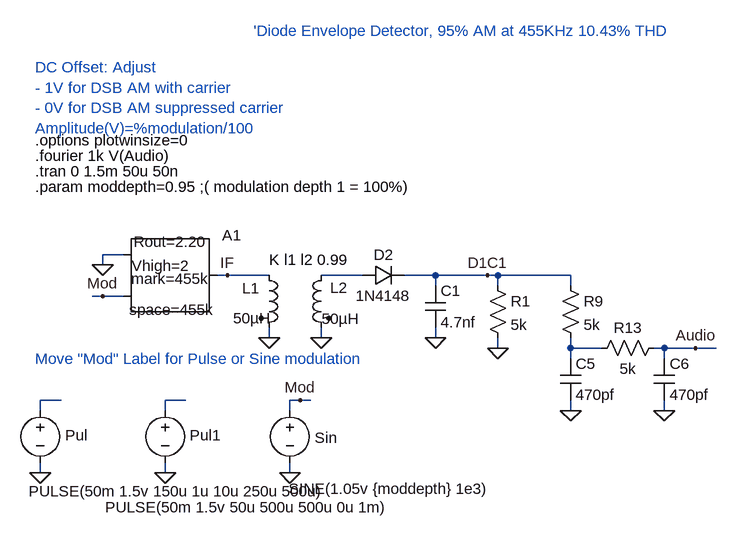
[diagram p0: schematic diode01.asc]
diode01.asc, the LTspice schematic file:
Version 4
SHEET 1 1240 792
WIRE -112 304 -144 304
WIRE -144 320 -144 304
WIRE 48 336 32 336
WIRE 112 336 48 336
WIRE 256 336 192 336
WIRE 368 336 320 336
WIRE 448 336 368 336
WIRE 464 336 448 336
WIRE 576 336 464 336
WIRE 368 352 368 336
WIRE 464 352 464 336
WIRE 576 352 576 336
WIRE -144 368 -160 368
WIRE -112 368 -144 368
WIRE 112 432 112 416
WIRE 192 432 192 416
WIRE 368 432 368 416
WIRE 464 448 464 432
WIRE 576 448 576 432
WIRE 624 448 576 448
WIRE 720 448 704 448
WIRE 768 448 720 448
WIRE 800 448 768 448
WIRE 576 464 576 448
WIRE 720 464 720 448
WIRE -208 528 -240 528
WIRE -16 528 -48 528
WIRE 160 528 144 528
WIRE 176 528 160 528
WIRE -240 544 -240 528
WIRE -48 544 -48 528
WIRE 144 544 144 528
WIRE 576 544 576 528
WIRE 720 544 720 528
WIRE -240 640 -240 624
WIRE -48 640 -48 624
WIRE 144 640 144 624
FLAG 144 640 0
FLAG -144 320 0
FLAG 48 336 IF
FLAG 768 448 Audio
FLAG 576 544 0
FLAG 720 544 0
FLAG -240 640 0
FLAG -144 368 Mod
FLAG 160 528 Mod
FLAG -48 640 0
FLAG 368 432 0
FLAG 448 336 D1C1
FLAG 112 432 0
FLAG 192 432 0
FLAG 464 448 0
SYMBOL SpecialFunctions\\modulate -112 304 R0
WINDOW 39 12 37 Left 0
WINDOW 40 9 85 Left 0
WINDOW 3 16 -20 Left 0
WINDOW 123 13 17 Left 0
SYMATTR SpiceLine mark=455k
SYMATTR SpiceLine2 space=455k
SYMATTR Value Rout=2.20
SYMATTR Value2 Vhigh=2
SYMATTR InstName A1
SYMBOL voltage 144 528 R0
WINDOW 123 0 0 Left 0
WINDOW 39 0 0 Left 0
WINDOW 0 38 58 Left 0
WINDOW 3 -2 136 Left 0
SYMATTR InstName Sin
SYMATTR Value SINE(1.05v {moddepth} 1e3)
SYMBOL res 560 336 R0
SYMATTR InstName R9
SYMATTR Value 5k
SYMBOL cap 560 464 R0
SYMATTR InstName C5
SYMATTR Value 470pf
SYMBOL res 720 432 R90
WINDOW 0 0 56 VBottom 0
WINDOW 3 32 56 VTop 0
SYMATTR InstName R13
SYMATTR Value 5k
SYMBOL cap 704 464 R0
SYMATTR InstName C6
SYMATTR Value 470pf
SYMBOL VOLTAGE -240 528 R0
WINDOW 0 38 54 Left 0
WINDOW 3 -18 140 Left 0
WINDOW 123 0 0 Left 0
WINDOW 39 0 0 Left 0
SYMATTR InstName Pul
SYMATTR Value PULSE(50m 1.5v 150u 1u 10u 250u 500u)
SYMBOL VOLTAGE -48 528 R0
WINDOW 0 38 54 Left 0
WINDOW 3 -92 165 Left 0
WINDOW 123 0 0 Left 0
WINDOW 39 0 0 Left 0
SYMATTR InstName Pul1
SYMATTR Value PULSE(50m 1.5v 50u 500u 500u 0u 1m)
SYMBOL cap 352 352 R0
SYMATTR InstName C1
SYMATTR Value 4.7nf
SYMBOL res 448 336 R0
SYMATTR InstName R1
SYMATTR Value 5k
SYMBOL diode 256 352 R270
WINDOW 0 32 32 VTop 0
WINDOW 3 0 32 VBottom 0
SYMATTR InstName D2
SYMATTR Value 1N4148
SYMBOL ind2 96 320 R0
WINDOW 0 -25 36 Left 0
WINDOW 3 -39 82 Left 0
SYMATTR InstName L1
SYMATTR Value 50µH
SYMATTR Type ind
SYMBOL ind2 208 320 M0
WINDOW 0 -25 35 Left 0
WINDOW 3 -43 83 Left 0
SYMATTR InstName L2
SYMATTR Value 50µH
SYMATTR Type ind
TEXT -248 152 Left 0 !.fourier 1k V(Audio)
TEXT -248 176 Left 0 !.tran 0 1.5m 50u 50n
TEXT -248 128 Left 0 !.options plotwinsize=0
TEXT 88 -40 Left 0 ;'Diode Envelope Detector, 95% AM at 455KHz 10.43% THD
TEXT -248 16 Left 0 ;DC Offset: Adjust\n- 1V for DSB AM with carrier\n- 0V for DSB AM suppressed carrier\nAmplitude(V)=%modulation/100
TEXT -248 200 Left 0 !.param moddepth=0.95 ;( modulation depth 1 = 100%)
TEXT -248 464 Left 0 ;Move "Mod" Label for Pulse or Sine modulation
TEXT 112 312 Left 0 !K l1 l2 0.99

The netlist it stands for:
* diode01.asc
A1 0 Mod 0 0 0 0 IF 0 MODULATOR Rout=2.20 Vhigh=2 mark=455k space=455k
V§Sin Mod 0 SINE(1.05v {moddepth} 1e3)
R9 D1C1 N002 5k
C5 N002 0 470pf
R13 Audio N002 5k
C6 Audio 0 470pf
V§Pul N003 0 PULSE(50m 1.5v 150u 1u 10u 250u 500u)
V§Pul1 N004 0 PULSE(50m 1.5v 50u 500u 500u 0u 1m)
C1 D1C1 0 4.7nf
R1 D1C1 0 5k
D2 N001 D1C1 1N4148
L1 IF 0 50µH
L2 N001 0 50µH
.model D D
.lib standard.dio
.fourier 1k V(Audio)
.tran 0 1.5m 50u 50n
.options plotwinsize=0
* 'Diode Envelope Detector, 95% AM at 455KHz 10.43% THD
* DC Offset: Adjust
* - 1V for DSB AM with carrier
* - 0V for DSB AM suppressed carrier
* Amplitude(V)=%modulation/100
.param moddepth=0.95 ;( modulation depth 1 = 100%)
* Move "Mod" Label for Pulse or Sine modulation
K l1 l2 0.99
.backanno
.end